# EAGLE design snimaci_cast (EAGLE 9.7.0)
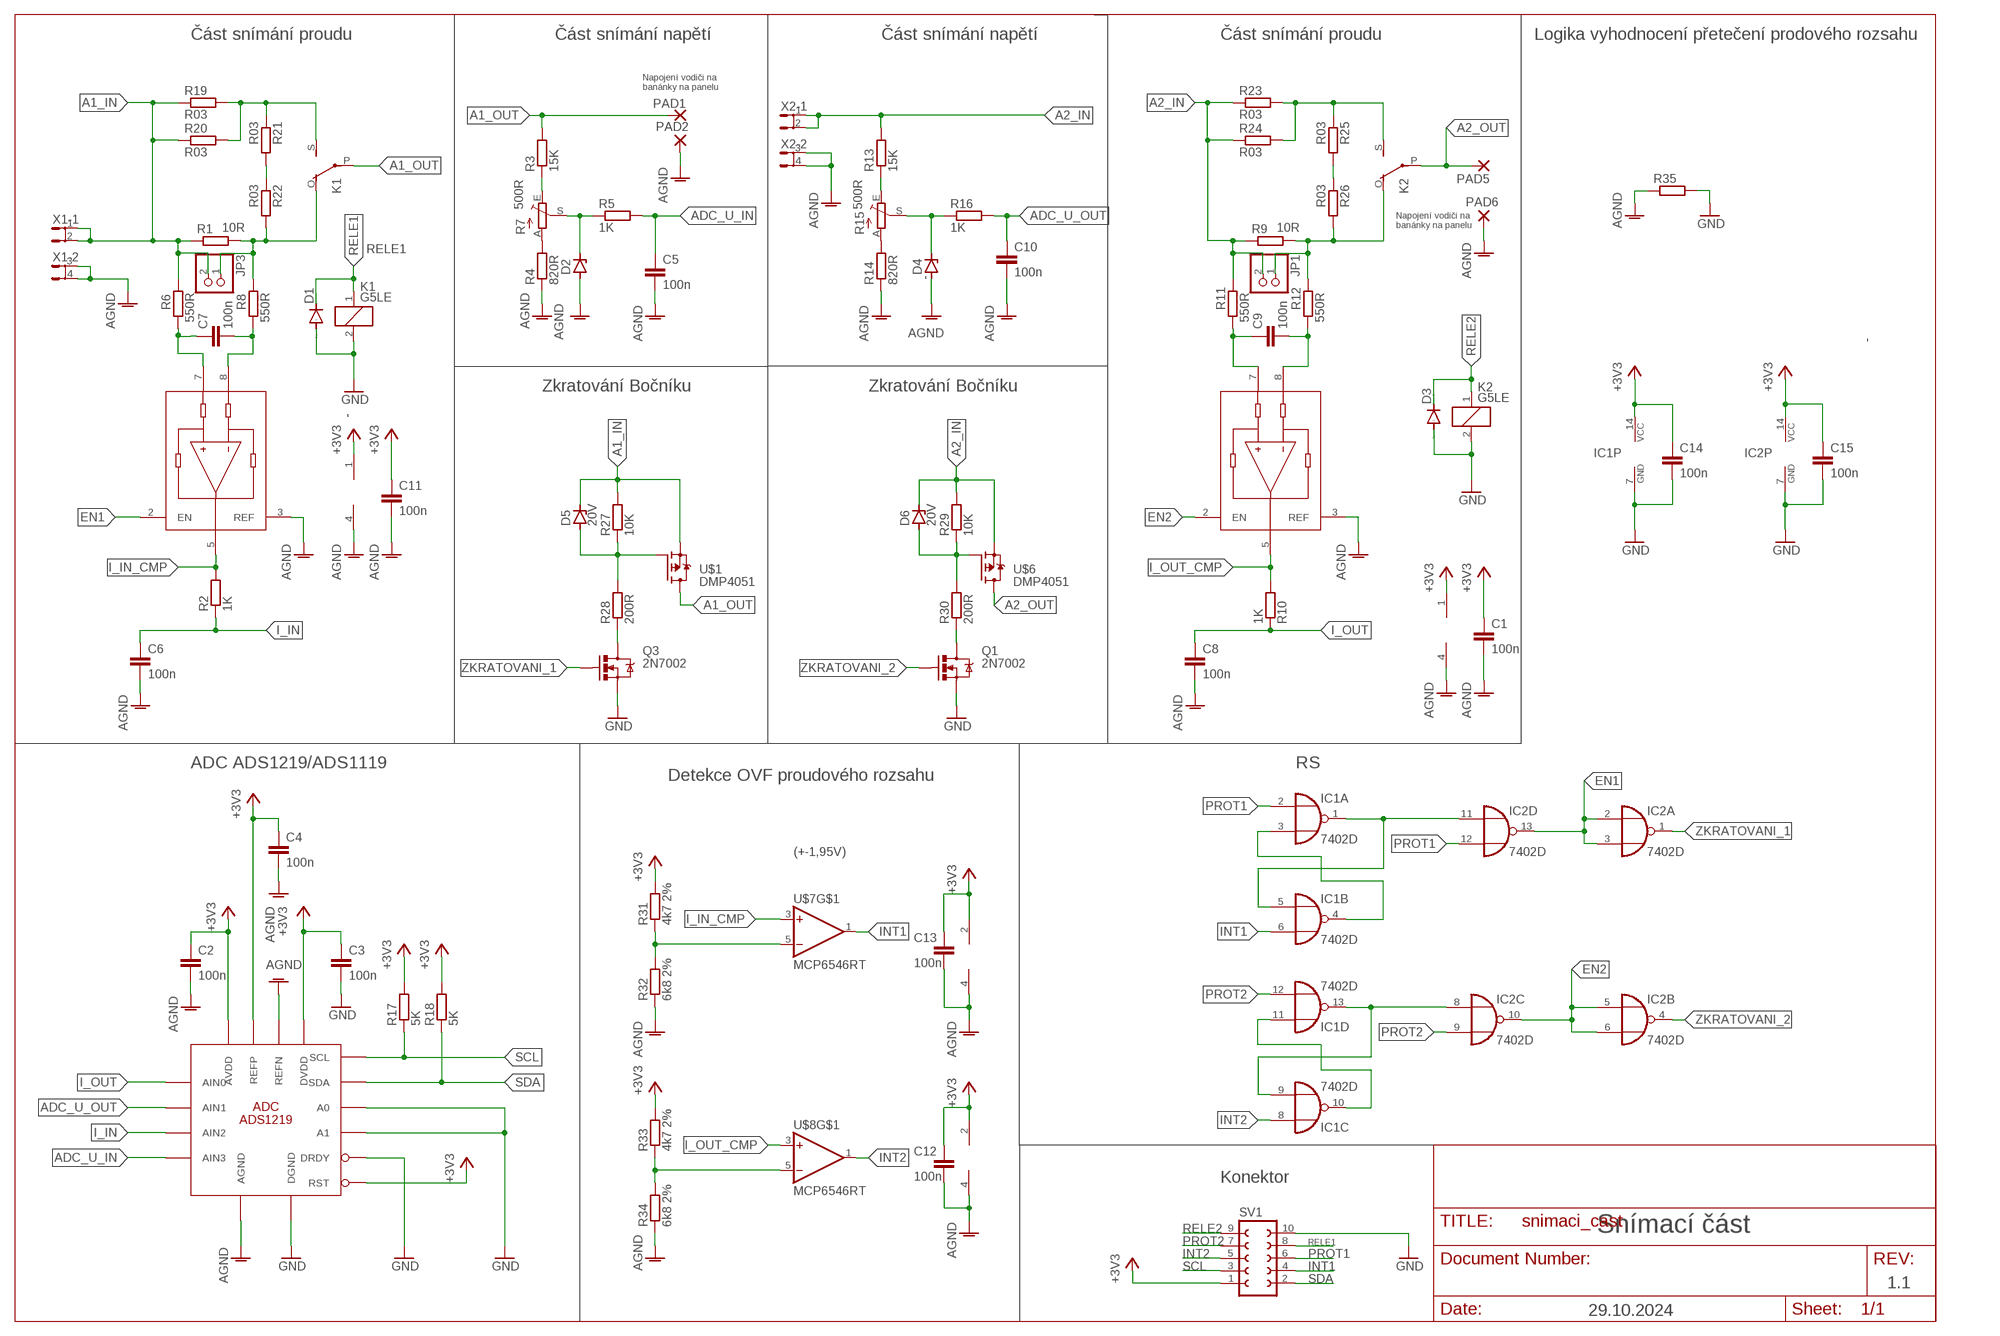
[diagram p0: schematic, sheet 1]

## Parts
C1  100n  C-EUC0805  [C0805]
C2  100n  C-EUC0805  [C0805]
C3  100n  C-EUC0805  [C0805]
C4  100n  C-EUC0805  [C0805]
C5  100n  C-EUC0805  [C0805]
C6  100n  C-EUC0805  [C0805]
C7  100n  C-EUC0805  [C0805]
C8  100n  C-EUC0805  [C0805]
C9  100n  C-EUC0805  [C0805]
C10  100n  C-EUC0805  [C0805]
C11  100n  C-EUC0805  [C0805]
C12  100n  C-EUC0805  [C0805]
C13  100n  C-EUC0805  [C0805]
C14  100n  C-EUC0805  [C0805]
C15  100n  C-EUC0805  [C0805]
D1  DIODE-MELF-MLL41  [MELF-MLL41]
D2  ZENER-DIODESOD80C  [SOD80C]
D3  DIODE-MELF-MLL41  [MELF-MLL41]
D4  ZENER-DIODESOD80C  [SOD80C]
D5  20V  ZENER-DIODESMB  [SMB]
D6  20V  ZENER-DIODESMB  [SMB]
IC1  7402D  [SO14]
IC2  7402D  [SO14]
JP1  PINHD-1X2  [1X02]
JP3  PINHD-1X2  [1X02]
K1  G5LE  [G5LE]
K2  G5LE  [G5LE]
PAD1  2,15/1,0  [2,15/1,0]
PAD2  2,15/1,0  [2,15/1,0]
PAD5  2,15/1,0  [2,15/1,0]
PAD6  2,15/1,0  [2,15/1,0]
Q1  2N7002  MOSFET-NCHANNEL2N7002PW  [SOT323]
Q3  2N7002  MOSFET-NCHANNEL2N7002PW  [SOT323]
R1  10R  R-EU_R1206  [R1206]
R2  1K  R-EU_R0805  [R0805]
R3  15K  R-EU_R0805  [R0805]
R4  820R  R-EU_R0805  [R0805]
R5  1K  R-EU_R0805  [R0805]
R6  550R  R-EU_R0805  [R0805]
R7  500R  TRIM_EU-PT10  [PT-10]
R8  550R  R-EU_R0805  [R0805]
R9  10R  R-EU_R1206  [R1206]
R10  1K  R-EU_R0805  [R0805]
R11  550R  R-EU_R0805  [R0805]
R12  550R  R-EU_R0805  [R0805]
R13  15K  R-EU_R0805  [R0805]
R14  820R  R-EU_R0805  [R0805]
R15  500R  TRIM_EU-PT10  [PT-10]
R16  1K  R-EU_R0805  [R0805]
R17  5K  R-EU_R0805  [R0805]
R18  5K  R-EU_R0805  [R0805]
R19  R03  R-EU_R1206  [R1206]
R20  R03  R-EU_R1206  [R1206]
R21  R03  R-EU_R1206  [R1206]
R22  R03  R-EU_R1206  [R1206]
R23  R03  R-EU_R1206  [R1206]
R24  R03  R-EU_R1206  [R1206]
R25  R03  R-EU_R1206  [R1206]
R26  R03  R-EU_R1206  [R1206]
R27  10K  R-EU_R0805  [R0805]
R28  200R  R-EU_R0805  [R0805]
R29  10K  R-EU_R0805  [R0805]
R30  200R  R-EU_R0805  [R0805]
R31  4k7 2%  R-EU_R0805  [R0805]
R32  6k8 2%  R-EU_R0805  [R0805]
R33  4k7 2%  R-EU_R0805  [R0805]
R34  6k8 2%  R-EU_R0805  [R0805]
R35  R-EU_R0805  [R0805]
SV1  FE05-2  [FE05-2]
U$1  DMP4051  [TO252]
U$2  ADS1219  [TSSOP16]
U$4  INA190  [SOT-23-THIN]
U$5  INA190  [SOT-23-THIN]
U$6  DMP4051  [TO252]
U$7  MCP6546RT  [SOT23-5]
U$8  MCP6546RT  [SOT23-5]
X1  SH5-2  [SH5-2]
X2  SH5-2  [SH5-2]

## Nets
+3V3: C1.1 C2.1 C3.1 C4.1 C11.1 C12.1 C13.1 C14.1 C15.1 IC1.14(P:VCC) IC2.14(P:VCC) R17.2 R18.2 R31.2 R33.2 SV1.1 U$2.3(RST) U$2.9(REFP) U$2.12(AVDD) U$2.13(DVDD) U$4.1(V+) U$5.1(V+) U$7.2(V+) U$8.2(V+)
A1_IN: D5.C JP3.2 R1.1 R6.2 R19.1 R20.1 R27.2 U$1.2(S) X1.1 X1.2
A1_OUT: K1.P(2:P) PAD1.1(P) R3.2 U$1.3(D)
A2_IN: D6.C JP1.2 R9.1 R11.2 R13.2 R23.1 R24.1 R29.2 U$6.2(S) X2.1 X2.2
A2_OUT: K2.P(2:P) PAD5.1(P) U$6.3(D)
ADC_U_IN: C5.1 R5.2 U$2.6(AIN3)
ADC_U_OUT: C10.1 R16.2 U$2.10(AIN1)
AGND: C1.2 C2.2 C4.2 C5.2 C6.2 C8.2 C10.2 C11.2 C12.2 C13.2 D2.A D4.A PAD2.1(P) PAD6.1(P) R4.1 R14.1 R32.1 R34.1 R35.1 U$2.5(AGND) U$2.8(REFN) U$4.3(REF) U$4.4(V-) U$5.3(REF) U$5.4(V-) U$7.4(V-) U$8.4(V-) X1.3 X1.4 X2.3 X2.4
EN1: IC2.2(A:I0) IC2.3(A:I1) IC2.13(D:O) U$4.2(EN)
EN2: IC2.5(B:I0) IC2.6(B:I1) IC2.10(C:O) U$5.2(EN)
GND: C3.2 C14.2 C15.2 D1.A D3.A IC1.7(P:GND) IC2.7(P:GND) K1.2 K2.2 Q1.2(S) Q3.2(S) R35.2 SV1.10 U$2.1(A0) U$2.2(A1) U$2.4(DGND) U$2.14(DRDY)
I_IN: C6.1 R2.1 U$2.7(AIN2)
I_IN_CMP: R2.2 U$4.5 U$7.3(+IN)
I_OUT: C8.1 R10.1 U$2.11(AIN0)
I_OUT_CMP: R10.2 U$5.5 U$8.3(+IN)
INT1: IC1.6(B:I1) SV1.4 U$7.1(OUT)
INT2: IC1.8(C:I0) SV1.5 U$8.1(OUT)
N$1: JP3.1 K1.O(2:O) R1.2 R8.2 R22.2
N$2: R3.1 R7.E
N$3: R4.2 R7.A
N$5: D2.C R5.1 R7.S
N$6: JP1.1 K2.O(2:O) R9.2 R12.2 R26.2
N$7: C7.2 R8.1 U$4.8(-)
N$9: D5.A R27.1 R28.2 U$1.1(G)
N$10: R31.1 R32.2 U$7.5(-IN)
N$11: Q3.3(D) R28.1
N$12: D6.A R29.1 R30.2 U$6.1(G)
N$13: R13.1 R15.E
N$14: R14.2 R15.A
N$15: D4.C R15.S R16.1
N$16: K1.S(2:S) R19.2 R20.2 R21.1
N$17: Q1.3(D) R30.1
N$18: C7.1 R6.1 U$4.7(+)
N$19: R21.2 R22.1
N$20: R33.1 R34.2 U$8.5(-IN)
N$21: K2.S(2:S) R23.2 R24.2 R25.1
N$23: R25.2 R26.1
N$24: IC1.3(A:I1) IC1.4(B:O)
N$26: IC1.10(C:O) IC1.11(D:I0)
OUT_N: C9.1 R11.1 U$5.7(+)
OUT_P: C9.2 R12.1 U$5.8(-)
PROT1: IC1.2(A:I0) IC2.12(D:I1) SV1.6
PROT2: IC1.12(D:I1) IC2.9(C:I1) SV1.7
Q_1: IC1.1(A:O) IC1.5(B:I0) IC2.11(D:I0)
Q_2: IC1.9(C:I1) IC1.13(D:O) IC2.8(C:I0)
RELE1: D1.C K1.1 SV1.8
RELE2: D3.C K2.1 SV1.9
SCL: R17.1 SV1.3 U$2.16(SCL)
SDA: R18.1 SV1.2 U$2.15(SDA)
ZKRATOVANI_1: IC2.1(A:O) Q3.1(G)
ZKRATOVANI_2: IC2.4(B:O) Q1.1(G)

## Notes on the sheet
- Část snímání proudu | Část snímání napětí | Část snímání napětí | Část snímání proudu | Logika vyhodnocení přetečení prodového rozsahu
- Napojení vodiči na
  banánky na panelu
- Napojení vodiči na
  banánky na panelu
- Zkratování Bočníku | Zkratování Bočníku
- ADC ADS1219/ADS1119 | RS
- Detekce OVF proudového rozsahu
- (+-1,95V)
- Konektor
- Snímací část
- 1.1
- 29.10.2024

## Library data of the parts
C1-C15 = rcl:C-EU: CAPACITOR, European symbol; SPICEPREFIX: C
D1 D3 = diode:DIODE-: DIODE
D2 D4-D6 = diode:ZENER-DIODE: Z-Diode
IC1 IC2 = 74xx-eu:74*02: Quad 2-input NOR gate
JP1 JP3 = pinhead:PINHD-1X2: PIN HEADER
K1 K2 = relay:G5LE: RELAY 1 x switch, 10 A/120 V AC, 8 A/30 V DC, Omron; OC_FARNELL: unknown; OC_NEWARK: unknown
PAD1 PAD2 PAD5 PAD6 = wirepad:2,15/1,0: THROUGH-HOLE PAD
Q1 Q3 = BeagleBone_Blue_R3:MOSFET-NCHANNEL: Common NMOSFET Parts MFG P/N Store ID Prod ID FDD8780 TRANS-09984 SI7820DN TRANS-11055 FDS6630A IC-08089 2N7002PW TRANS-11151 FQP30N06L COM-10213 TRANS-10060 BSS123LT1G TRANS-08345 BSS138 TRANS-00830 BS170 2N7000; PROD_ID: TRANS-11151
R1-R6 R8-R14 R16-R35 = rcl:R-EU_: RESISTOR, European symbol; SPICEPREFIX: R
R7 R15 = pot:TRIM_EU-: POTENTIOMETER
SV1 = con-lsta:FE05-2: FEMALE HEADER; OC_FARNELL: unknown; OC_NEWARK: unknown
U$1 U$6 = Mosfety:DMP4051
U$2 = ADC_TI:ADS1219
U$4 U$5 = merici_zesilovace:INA190
U$7 U$8 = merici_zesilovace:MCP6546RT
X1 X2 = con-rib:SH5-2: RIBBON CABLE CONNECTOR Flachstecker / Faston; OC_FARNELL: unknown; OC_NEWARK: unknown

## Board
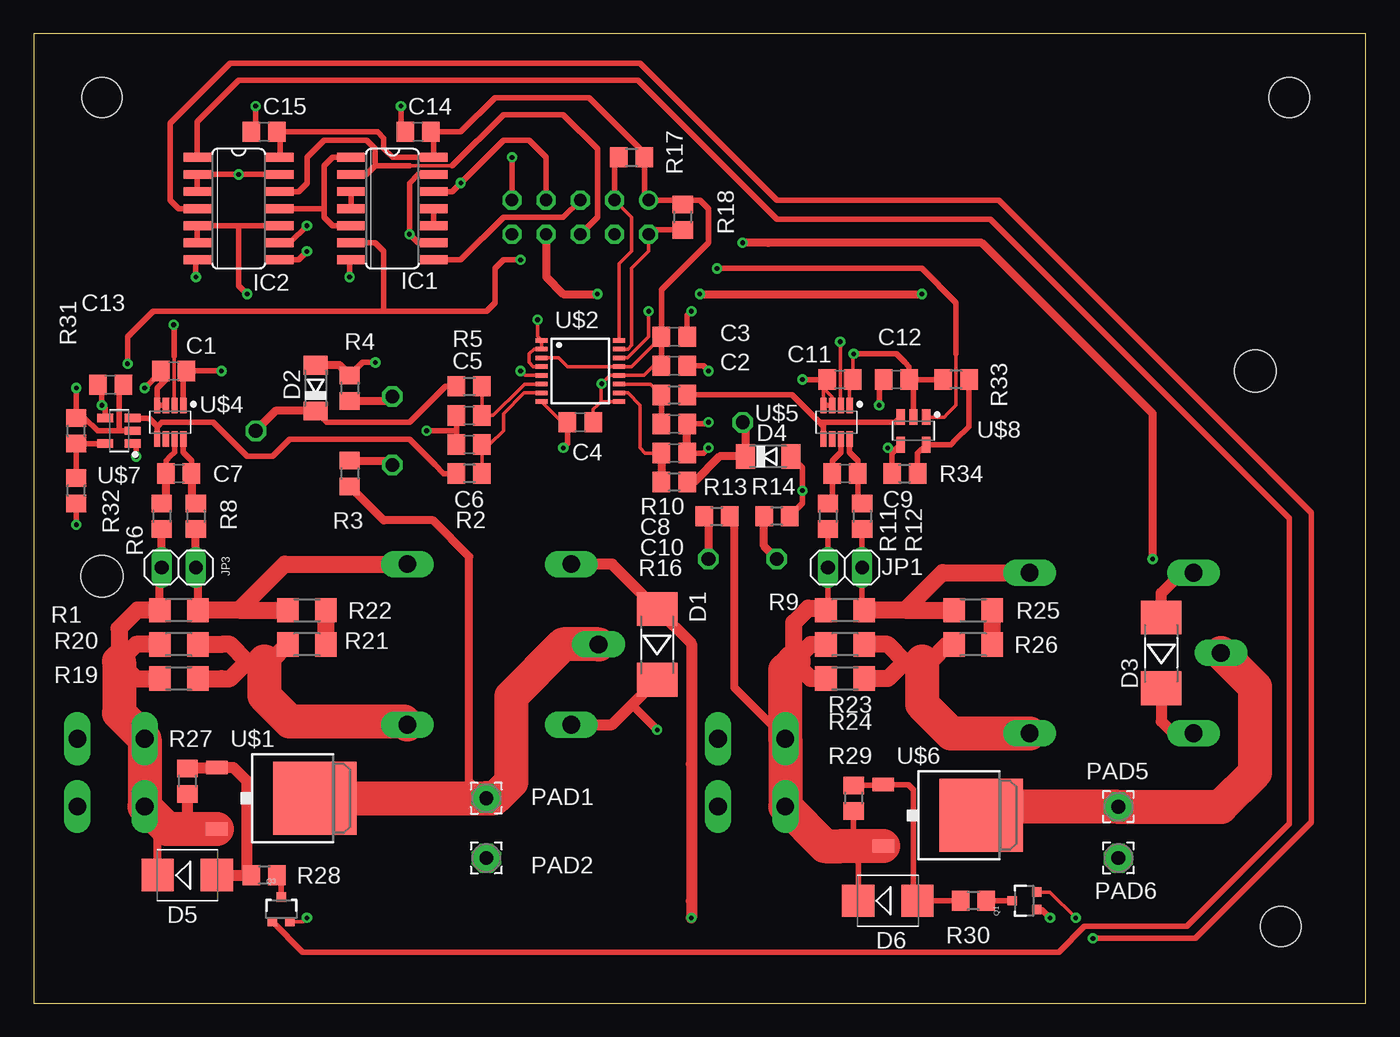
[diagram p1: board, top side]
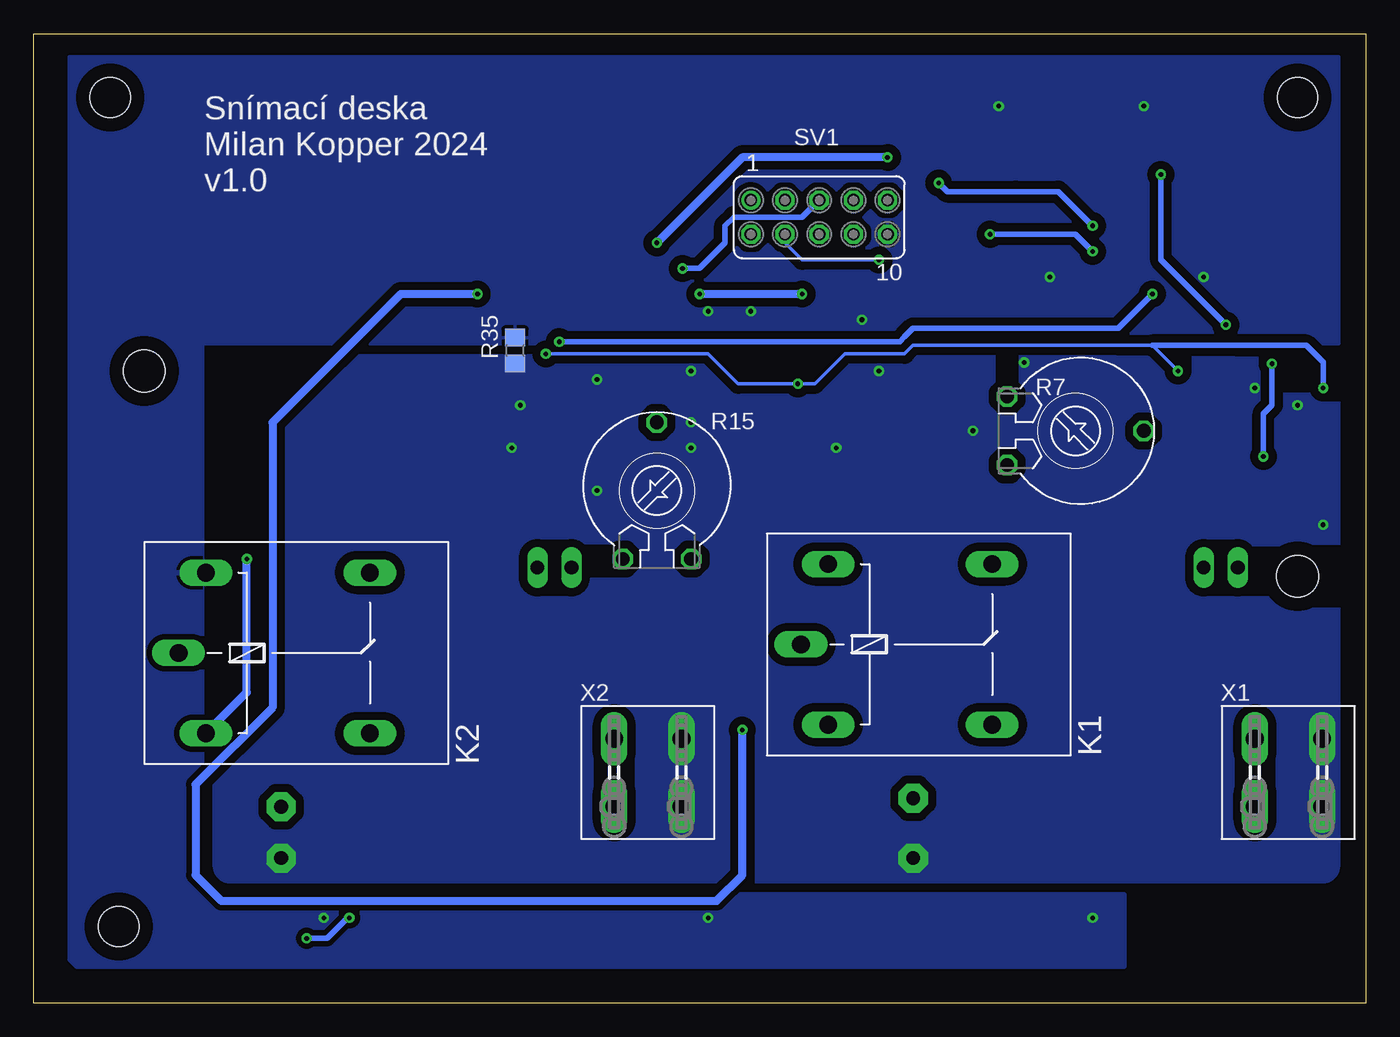
[diagram p2: board, bottom side, seen from below]

Size 99.04 x 72.06 mm. Coordinates in mm from the lower left corner, seen from the top.
Outline: 0,0 99.04,0 99.04,72.06 0,72.06 0,0
Copper layers (1*16): Top 0.035mm / dielectric 1.5mm / Bottom 0.035mm
Design rules "Fusion Electronics Design Rules": minimum track width 6mil, minimum drill 0.35mm, track to track 6mil, track to pad 6mil, pad to pad 6mil, via to via 6mil, smd to smd 6mil, copper to edge 40mil, drill to drill 6mil, minimum pad ring 10mil, minimum via ring 8mil, stop-mask expansion 4mil, vias tented up to drill 0mil, thermal gap 10mil
Holes 3 mm at 93.34,67.31 5.08,67.31 92.71,5.72
Holes 3.1 mm at 5.08,31.75 90.8,46.99

### Footprints (pad centres in the part's own frame; a part is rotated, then mirrored left to right if it is on the bottom)
C0805 = smd 1.3 x 1.5: 1 -0.95,0; 2 0.95,0
MELF-MLL41 = smd 2.5 x 3: A 2.625,0; C -2.625,0
SOD80C = smd 1.4 x 1.8: A 1.7,0; C -1.7,0
SMB = smd 2.4 x 2.4: A 2.2,0; C -2.2,0
SO14 = smd 0.66 x 2.032: 1 -3.81,-3.073; 2 -2.54,-3.073; 3 -1.27,-3.073; 4 0,-3.073; 5 1.27,-3.073; 6 2.54,-3.073; 7 3.81,-3.073; 8 3.81,3.073; 9 2.54,3.073; 10 1.27,3.073; 11 0,3.073; 12 -1.27,3.073; 13 -2.54,3.073; 14 -3.81,3.073
1X02 = drill 1.016 long: 1 -1.27,0; 2 1.27,0
G5LE = drill 1.321 long: 1 -7.493,-5.969; 2 -7.493,5.969; O 4.699,5.969; P -9.525,0; S 4.699,-5.969
2,15/1,0 = drill 1.016 pad 2.159 octagon: 1 0,0
SOT323 = smd 0.7 x 0.7: 1 -0.65,-0.925; 2 0.65,-0.925; 3 0,0.925
R1206 = smd 1.6 x 1.803: 1 -1.422,0; 2 1.422,0
R0805 = smd 1.3 x 1.5: 1 -0.95,0; 2 0.95,0
PT-10 = drill 1.016 octagon: A -2.54,-5.08; E 2.54,-5.08; S 0,5.08
FE05-2 = drill 0.914: 1 -5.08,1.27 | drill 0.914 octagon: 2 -5.08,-1.27; 3 -2.54,1.27; 4 -2.54,-1.27; 5 0,1.27; 6 0,-1.27; 7 2.54,1.27; 8 2.54,-1.27; 9 5.08,1.27; 10 5.08,-1.27
TO252 = smd 1 x 1.6: 1 -2.28,-4.8; 2 2.28,-4.8 | smd 5.4 x 6.2: 3 0,2.5
TSSOP16 = smd 0.9 x 0.35: 1 -2.875,2.275; 2 -2.875,1.625; 3 -2.875,0.975; 4 -2.875,0.325; 5 -2.875,-0.325; 6 -2.875,-0.975; 7 -2.875,-1.625; 8 -2.875,-2.275; 9 2.875,-2.275; 10 2.875,-1.625; 11 2.875,-0.975; 12 2.875,-0.325; 13 2.875,0.325; 14 2.875,0.975; 15 2.875,1.625; 16 2.875,2.275
SOT-23-THIN = smd 1.18 x 0.478: 1 -1.246,0.975; 2 -1.246,0.325; 3 -1.246,-0.325; 4 -1.246,-0.975; 5 1.246,-0.975; 6 1.246,-0.325; 7 1.246,0.325; 8 1.246,0.975
SOT23-5 = smd 1.182 x 0.612: 1 -1.025,0.95; 2 -1.025,0; 3 -1.025,-0.95; 4 1.025,-0.95; 5 1.025,0.95
SH5-2 = drill 1.321 long: 1 0,-2.515; 2 0,2.515; 3 5.004,-2.515; 4 5.004,2.515

### Placement (x,y rotation side)
C1  10.41,46.99 180 top
C2  47.62,47.37 0 top
C3  47.62,49.53 0 top
C4  40.64,43.18 180 top
C5  32.39,43.69 180 top
C6  32.39,41.53 180 top
C7  10.79,39.37 0 top
C8  47.62,43.05 0 top
C9  60.33,39.37 0 top
C10  47.62,40.89 0 top
C11  59.94,46.36 180 top
C12  64.13,46.36 180 top
C13  5.71,45.97 180 top
C14  28.57,64.77 180 top
C15  17.14,64.77 180 top
D1  46.35,26.67 90 top
D2  20.96,45.72 90 top
D3  83.82,26.04 90 top
D4  54.61,40.64 0 top
D5  11.43,9.53 0 top
D6  63.5,7.62 0 top
IC1  26.67,59.06 270 top
IC2  15.24,59.06 270 top
JP1  60.33,32.39 180 top
JP3  10.79,32.39 180 top
K1  32.47,26.67 0 bottom
K2  78.74,26.04 0 bottom
PAD1  33.66,15.24 0 top
PAD2  33.66,10.79 0 top
PAD5  80.64,14.61 0 top
PAD6  80.64,10.79 0 top
Q1  73.66,7.62 90 top
Q3  18.42,6.99 0 top
R1  10.79,29.21 0 top
R2  32.39,39.37 180 top
R3  23.5,39.37 270 top
R4  23.5,45.72 270 top
R5  32.39,45.85 0 top
R6  9.53,36.2 270 top
R7  21.59,42.55 270 bottom
R8  12.07,36.2 270 top
R9  60.33,29.21 0 top
R10  47.62,45.21 0 top
R11  59.05,36.2 270 top
R12  61.59,36.2 270 top
R13  50.8,36.2 0 top
R14  55.24,36.2 180 top
R15  52.7,38.1 0 bottom
R16  47.62,38.73 180 top
R17  44.45,62.87 0 top
R18  48.26,58.42 90 top
R19  10.79,24.13 0 top
R20  10.79,26.67 0 top
R21  20.32,26.67 0 top
R22  20.32,29.21 180 top
R23  60.33,26.67 0 top
R24  60.33,24.13 0 top
R25  69.85,26.67 0 top
R26  69.85,29.21 180 top
R27  11.43,16.51 270 top
R28  17.14,9.53 180 top
R29  60.96,15.24 270 top
R30  69.85,7.62 180 top
R31  3.18,42.55 90 top
R32  3.18,38.1 90 top
R33  68.58,46.36 180 top
R34  64.77,39.37 0 top
R35  63.25,48.51 90 bottom
SV1  40.64,58.42 0 bottom
U$1  18.42,15.24 270 top
U$2  40.64,46.99 0 top
U$4  10.16,43.18 270 top
U$5  59.69,43.18 270 top
U$6  67.94,13.97 270 top
U$7  6.35,42.55 180 top
U$8  65.41,42.55 270 top
X1  8.25,17.15 0 bottom
X2  55.88,17.15 0 bottom

### Tracks (layer width: path | path; a pad name or v marks a point on that pad's centre or on a via)
+3V3  (via drill 0.35)
  Top 0.254: U$5.1 60.66,46.13 C11.1 60.89,48.19 v60.96,48.26 | C4.1 41.59,44.13 41.91,44.45 42.17,44.72 | 42.17,44.72 U$2.9 | C2.1 46.1,47.37 45.72,46.99 45.39,46.66 U$2.12 42.85,46.66 v42.23,46.04 42.17,45.98 42.17,44.72 | U$2.3 39.03,47.97 39.37,47.62 39.68,47.32 U$2.13 44.45,47.32 46.66,49.53 C3.1
  Top 0.406: 45.4,62.23 R17.2 | 45.4,62.23 45.4,60.01 SV1.1 47.94,59.69 R18.2 48.58,59.69 49.53,59.69 50.16,59.06 50.16,56.52 49.53,55.88 46.67,53.03 C3.1 C2.1 | U$4.1 11.14,46.76 C1.1 v13.97,46.99 | 6.35,42.55 5.71,42.55 5.08,42.55 4.76,42.55 3.81,43.5 R31.2 v3.18,45.72 | v60.96,48.26 64.13,48.26 64.77,47.62 65.08,47.31 C12.1 | 65.41,46.04 65.41,45.72 | 65.41,45.72 U$8.2 | C12.1 R33.2 | IC2.14 18.31,64.55 C15.1 25.55,64.77 26.04,64.29 26.04,64.14 26.04,63.5 26.67,62.87 IC1.14 29.74,64.55 C14.1 31.75,64.77 34.29,67.31 40,67.31 41.27,67.31 45.08,63.5 45.4,63.19 45.4,62.23 | C12.1 65.41,46.04 | 65.41,46.04 65.41,45.72 | 6.35,42.55 U$7.2 | 6.35,42.55 6.38,42.58 6.38,45.69 6.35,45.72 6.6,45.97 C13.1
  Bottom 0.254: v60.96,48.26 48.89,48.26 46.67,46.04 v42.23,46.04 40.96,46.04 38.73,48.26 34.29,48.26 33.66,48.9 18.42,48.9 15.87,48.9 v13.97,46.99
  Bottom 0.406: 15.87,48.9 9.53,48.9 4.44,48.9 3.18,47.62 v3.18,45.72
A1_IN
  Top 0.61: R1.1 9.37,32.23 JP3.2 R6.2 | D5.C 9.23,12.26 9.93,12.96
  Top 0.813: R27.2 11.43,13.48 11.95,12.96
  Top 1.27: R20.1 7.62,26.67 6.35,25.4 | 6.35,25.4 6.99,24.77 7.62,24.13 R19.1 | R1.1 7.7,29.21 6.35,27.86 6.35,25.4
  Top 2.54: 11.95,12.96 | 11.95,12.96 U$1.2 | 6.35,25.4 6.35,21.57 X1.2 X1.1 9.93,12.96 11.95,12.96
A1_OUT
  Top 0.61: PAD1.1 32.39,16.51 32.39,33.2 29.71,35.88 26.04,35.88 R3.2
  Top 2.54: 34.29,15.24 PAD1.1 | 34.29,15.24 35.5,16.45 35.5,22.8 39.37,26.67 K1.P | U$1.3 34.29,15.24
A2_IN
  Top 0.406: D6.C 61.3,10.46 60.06,11.69 60.96,12.58 R29.2 | R9.1 59.05,29.36 JP1.2 R11.2
  Top 0.61: R13.2 52.07,35.88 52.07,33.66 52.07,30.48 52.07,23.47 X2.2
  Top 1.27: 56.52,25.4 57.78,26.67 R23.1 | 56.52,25.4 57.78,24.13 R24.1 | 56.52,25.4 56.52,26.67 56.52,28.29 57.44,29.21 57.59,29.36 59.05,29.36
  Top 2.54: U$6.2 60.06,11.69 58.82,11.69 X2.1 X2.2 55.88,24.77 56.52,25.4
A2_OUT
  Top 2.54: U$6.3 71.08,14.61 PAD5.1 88.27,14.61 90.8,17.15 90.8,23.5 K2.P
ADC_U_IN
  Top 0.254: R5.2 C5.1 34.16,43.69 36.19,45.72 36.49,46.02 U$2.6
ADC_U_OUT
  Top 0.254: U$2.10 44.17,45.37 45.08,44.45 45.08,41.28 45.47,40.89 C10.1
  Top 0.61: C10.1 R16.2
AGND  (via drill 0.35)
  Top 0.254: 58.71,45.72 U$5.4 | 58.71,45.72 58.71,46.08 C11.2 | U$5.3 59.36,45.07 58.71,45.72 | U$2.5 36.52,46.66 v36.19,46.99 | U$2.8 39.3,43.18 C4.2 | 5.08,45.66 C13.2
  Top 0.406: C6.2 31.43,42.55 | 31.43,42.55 C5.2 | U$5.3 U$5.4 | U$8.4 63.82,40.89 | 63.82,40.89 R34.1 | C2.2 49.78,47.37 v50.16,46.99 | C8.2 50.04,43.05 v50.16,43.18 | C10.2 49.78,40.89 v50.16,41.28 | C4.2 39.69,41.59 v39.37,41.28 | U$7.4 5.32,44.21 v5.08,44.45 5.08,45.66 C13.2 | v8.25,45.72 9.46,46.93 C1.2 9.83,46.62 9.83,46.36 9.18,45.71 U$4.4 U$4.3 | R4.1 24.45,47.62 v25.4,47.62 | v29.21,42.55 31.43,42.55 | D4.A 57.15,39.8 v57.15,38.1 57.15,37.15 R14.1 | v62.86,44.45 62.86,46.04 C12.2 | v57.15,46.36 C11.2 | v63.5,41.28 63.82,40.96 63.82,40.89 | R32.1 v3.18,35.56
  Top 0.61: R4.1 22.75,47.42 D2.A | C10.2 C8.2
  pour Bottom (isolate 0.61): 3.18,10.16 84.45,10.16 84.45,46.99 3.18,46.99
EN1  (via drill 0.35)
  Top 0.254: U$4.2 10.49,44.8 10.43,44.85 10.43,48.08
  Top 0.406: IC2.13 v15.24,61.59 IC2.2 IC2.3 | 10.43,48.08 10.43,50.4 v10.41,50.42
  Bottom 0.406: v10.41,50.42 15.24,55.25 v15.24,61.59
EN2  (via drill 0.35)
  Top 0.254: U$5.2 60.02,44.8 59.96,44.85 59.96,46.99 59.96,48.9
  Top 0.406: 59.96,48.9 v59.96,49.17 | IC2.6 IC2.5 12.7,57.78 15.24,57.78 | 15.24,57.78 15.87,57.78 IC2.10 | 15.24,57.78 15.24,53.34 v15.87,52.7
  Bottom 0.406: v59.96,49.17 34.65,49.17 34.29,49.53 33.66,50.16 18.42,50.16 v15.87,52.7
GND  (via drill 0.35)
  Top 0.254: U$2.4 37.14,47.32 36.83,47.62 36.83,48.26 37.19,48.62 U$2.2 U$2.1 37.46,49.57 v37.46,50.8 | U$2.14 44.16,47.97 45.08,48.9 45.72,49.53 v45.72,51.44 | Q3.2 20.03,6.06 v20.32,6.35 | Q1.2 75.55,8.27 v77.47,6.35
  Top 0.406: v12.07,53.98 12.07,55.14 IC2.7 | v23.5,53.98 23.5,55.25 IC1.7 | C3.2 48.58,51.12 v48.89,51.44 | C15.2 16.51,65.09 v16.51,66.67 | v27.3,66.67 27.3,65.09 C14.2
  Top 0.813: K1.2 43.01,32.64 D1.A 48.89,26.76 48.89,17.78 48.89,7.62 v48.89,6.35 | D3.A 83.82,30.48 85.09,31.75 85.34,32 K2.2
  pour Bottom (isolate 0.61): 2.03,49.02 96.39,49.02 96.39,70.36 2.03,70.36
  pour Bottom (isolate 0.406): 86.53,8.14 86.48,8.08 86.4,8.05 17.98,8.05 17.98,2.74 95.8,2.74 96.32,3.26 96.32,49.33 86.56,49.33 86.56,8.21
I_IN
  Top 0.254: R2.1 C6.1 33.91,41.53 34.92,42.55 34.92,43.82 36.47,45.37 U$2.7
I_IN_CMP
  Top 0.406: U$4.5 9.18,42.84 9.21,42.86 | 9.21,42.86 9.53,43.18 13.33,43.18 15.87,40.64 17.78,40.64 18.42,41.28 19.05,41.91 27.94,41.91 29.85,40.01 30.48,39.37 R2.2 | 9.21,42.86 8.57,43.5 U$7.3
I_OUT
  Top 0.254: U$2.11 45.87,46.02 R10.1
  Top 0.406: C8.1 R10.1
I_OUT_CMP
  Top 0.406: U$5.5 58.71,42.89 58.42,43.18 | 58.42,43.18 56.39,45.21 R10.2 | 58.42,43.18 63.5,43.18 64.06,43.18 U$8.3
INT1  (via drill 0.35)
  Top 0.406: U$7.1 7.62,41.35 v7.62,40.64 | v6.99,47.53 6.99,49.53 8.89,51.44 9.53,51.44 26.04,51.44 | 26.04,51.44 27.94,51.44 33.02,51.44 33.66,51.44 34.29,52.07 34.29,54.61 34.92,55.25 v36.19,55.25 | IC1.6 25.4,56.52 26.04,55.88 26.04,51.44
  Bottom 0.254: v36.19,55.25 41.91,55.25 43.18,56.52 SV1.4
  Bottom 0.406: v7.62,40.64 7.62,43.82 6.99,44.45 v6.99,47.53
INT2  (via drill 0.35)
  Top 0.254: U$8.1 67.7,43.57 67.94,43.82 68.58,44.45 68.58,48.26
  Top 0.406: 68.58,48.26 68.58,52.07 66.04,54.61 v50.8,54.61 | IC1.8 31.75,55.25 34.92,58.42 39.37,58.42 SV1.5
  Bottom 0.406: v50.8,54.61 49.53,54.61 48.89,55.25 47.62,56.52 47.62,57.78 46.99,58.42 45.08,58.42 41.91,58.42 SV1.5
N$1
  Top 0.61: R1.2 12.22,32.23 JP3.1 R8.2
  Top 1.27: R22.2 15.87,29.21 15.24,29.21 | 15.24,29.21 R1.2 | 15.24,29.21 17.78,31.75 18.67,32.64 K1.O
N$2
  Top 0.61: R3.1 26.36,40.32 R7.E
N$3
  Top 0.61: R4.2 26.36,44.77 R7.A
N$5
  Top 0.406: D2.C 21.79,43.18 27.94,43.18 29.85,45.09 30.61,45.85 R5.1
  Top 0.61: R7.S 17.99,44.02 D2.C
N$6
  Top 0.406: R9.2 61.59,29.36 JP1.1 R12.2
  Top 1.27: 64.77,29.21 R9.2 | 64.77,29.21 R26.2 | 64.77,29.21 67.56,32 K2.O
N$7
  Top 0.406: C7.2 11.75,40.33 11.43,40.64 11.14,40.94 U$4.8
  Top 0.61: C7.2 11.75,37.47 R8.1
N$9
  Top 0.813: R27.1 11.49,17.52 U$1.1 14.86,17.52 15.87,16.51 15.87,9.85 R28.2 D5.A
N$10
  Top 0.406: R32.2 R31.1 U$7.5
N$11
  Top 0.406: R28.1 18.42,9.21 Q3.3
N$12
  Top 0.406: R29.1 63.08,16.19 U$6.1 65.03,16.25 65.41,15.88 65.41,9.53 65.41,7.92 D6.A R30.2
N$13
  Top 0.61: R13.1 50.16,35.88 R15.E
N$14
  Top 0.61: R15.A 54.3,33.97 R14.2
N$15
  Top 0.61: R15.S 52.91,42.98 D4.C 51,40.64 49.1,38.73 R16.1
N$16
  Top 1.27: R20.2 13.97,26.67 14.61,26.67 15.87,25.4 | R19.2 13.97,24.13 14.61,24.13 15.87,25.4 | 15.87,25.4 17.14,25.4 17.63,25.4 R21.1
  Top 2.54: 17.14,25.4 17.14,22.86 19.05,20.96 23.3,20.96 27.52,20.96 K1.S
N$17
  Top 0.406: Q1.3 R30.1
N$18
  Top 0.406: U$4.7 10.49,40.97 10.16,40.64 9.85,40.33 C7.1
  Top 0.61: C7.1 9.85,37.47 R6.1
N$19
  Top 1.27: R21.2 R22.1
N$20
  Top 0.406: R33.1 69.53,42.86 68.58,41.91 68.19,41.52 U$8.5 65.72,40.89 R34.2
N$21
  Top 1.27: R23.2 63.5,26.67 64.77,25.4 | 64.77,25.4 63.5,24.13 R24.2 | R25.1 67.94,26.67 66.67,25.4 66.04,25.4 64.77,25.4
  Top 2.54: 66.04,25.4 66.04,22.23 68.2,20.07 K2.S
N$23
  Top 1.27: R25.2 R26.1
N$24
  Top 0.406: IC1.3 IC1.4
N$26
  Top 0.406: IC1.11 IC1.10
OUT_N
  Top 0.406: R11.1 59.38,37.47 C9.1 59.38,40.33 60.02,40.97 U$5.7
OUT_P
  Top 0.406: R12.1 61.27,37.47 C9.2 61.27,40.33 60.66,40.94 U$5.8
PROT1
  Top 0.254: 31.11,62.23 27.94,62.23
  Top 0.406: SV1.6 41.91,58.42 41.91,60.96 41.91,62.87 41.91,63.5 39.37,66.04 34.92,66.04 31.11,62.23 | IC1.2 24.76,61.59 25.4,62.23 | 25.4,62.23 25.4,63.5 24.76,64.14 22.86,64.14 21.59,64.14 20.32,62.87 20.32,62.23 20.32,60.96 19.68,60.33 IC2.12 | 25.4,62.23 27.3,62.23 27.94,62.23
PROT2  (via drill 0.35)
  Top 0.406: SV1.7 38.1,62.87 36.83,64.14 34.92,64.14 34.29,63.5 v31.75,60.96 31.11,60.33 IC1.12 | v20.32,57.78 19.05,56.52 IC2.9
  Bottom 0.406: v31.75,60.96 31.11,60.33 26.04,60.33 22.86,60.33 v20.32,57.78
Q_1
  Top 0.406: IC1.5 22.22,57.78 21.59,58.42 21.59,59.06 | 21.59,59.06 21.59,62.23 22.22,62.87 22.86,62.87 IC1.1 | IC2.11 21.59,59.06
Q_2  (via drill 0.35)
  Top 0.406: IC1.9 28.57,56.52 v27.94,57.15 27.94,57.78 27.94,60.96 28.57,61.59 IC1.13 | IC2.8 19.68,55.25 v20.32,55.88
  Bottom 0.406: v20.32,55.88 21.59,57.15 v27.94,57.15
RELE1  (via drill 0.35)
  Top 0.61: SV1.8 38.1,53.98 39.37,52.7 v41.91,52.7 | v46.35,20.32 44.49,22.18 | v49.53,52.7 v66.04,52.7
  Top 0.813: D1.C 44.49,22.18 43.01,20.7 K1.1
  Bottom 0.61: v46.35,20.32 46.35,9.53 48.26,7.62 85.09,7.62 86.99,9.53 86.99,16.27 81.28,21.98 81.28,43.18 71.75,52.7 v66.04,52.7 | v41.91,52.7 v49.53,52.7
RELE2  (via drill 0.35)
  Top 0.406: SV1.9 v35.56,62.87
  Top 0.61: v83.19,33.02 83.19,43.82 77.47,49.53 70.48,56.52 54.61,56.52 v52.7,56.52
  Top 0.813: D3.C 83.82,20.96 84.71,20.07 K2.1
  Bottom 0.61: v35.56,62.87 46.35,62.87 48.89,60.33 v52.7,56.52 | K2.1 83.19,23.11 v83.19,33.02
SCL
  Top 0.254: U$2.16 43.52,54.95 44.45,55.88 44.45,57.78 44.45,58.42 SV1.3
  Top 0.406: SV1.3 43.18,62.55 R17.1
SDA
  Top 0.254: U$2.15 44.17,48.62 44.45,48.9 44.45,53.34 44.45,54.61 45.72,55.88 SV1.2
  Top 0.406: SV1.2 46.04,57.47 R18.1
ZKRATOVANI_1
  Top 0.406: IC2.1 12.17,65.51 15.24,68.58 38.73,68.58 44.45,68.58 44.94,68.58 55.24,58.27 71.12,58.27 93.34,36.05 93.34,33.02 93.34,13.33 86.99,6.99 85.72,5.72 78.1,5.72 76.2,3.81 55.24,3.81 51.44,3.81 20.01,3.81 Q3.1
ZKRATOVANI_2  (via drill 0.35)
  Top 0.406: IC2.4 10.79,59.06 10.16,59.69 10.16,65.41 14.61,69.85 38.73,69.85 45.08,69.85 49.53,65.41 55.24,59.69 71.75,59.69 94.98,36.46 94.98,13.45 93.15,11.62 86.36,4.83 v78.74,4.83 | Q1.1 74.94,6.97 v75.56,6.35
  Bottom 0.406: v78.74,4.83 77.22,4.83 75.69,6.35 v75.56,6.35

### Text on the board
bPlace: Snímací deska / Milan Kopper 2024 / v1.0